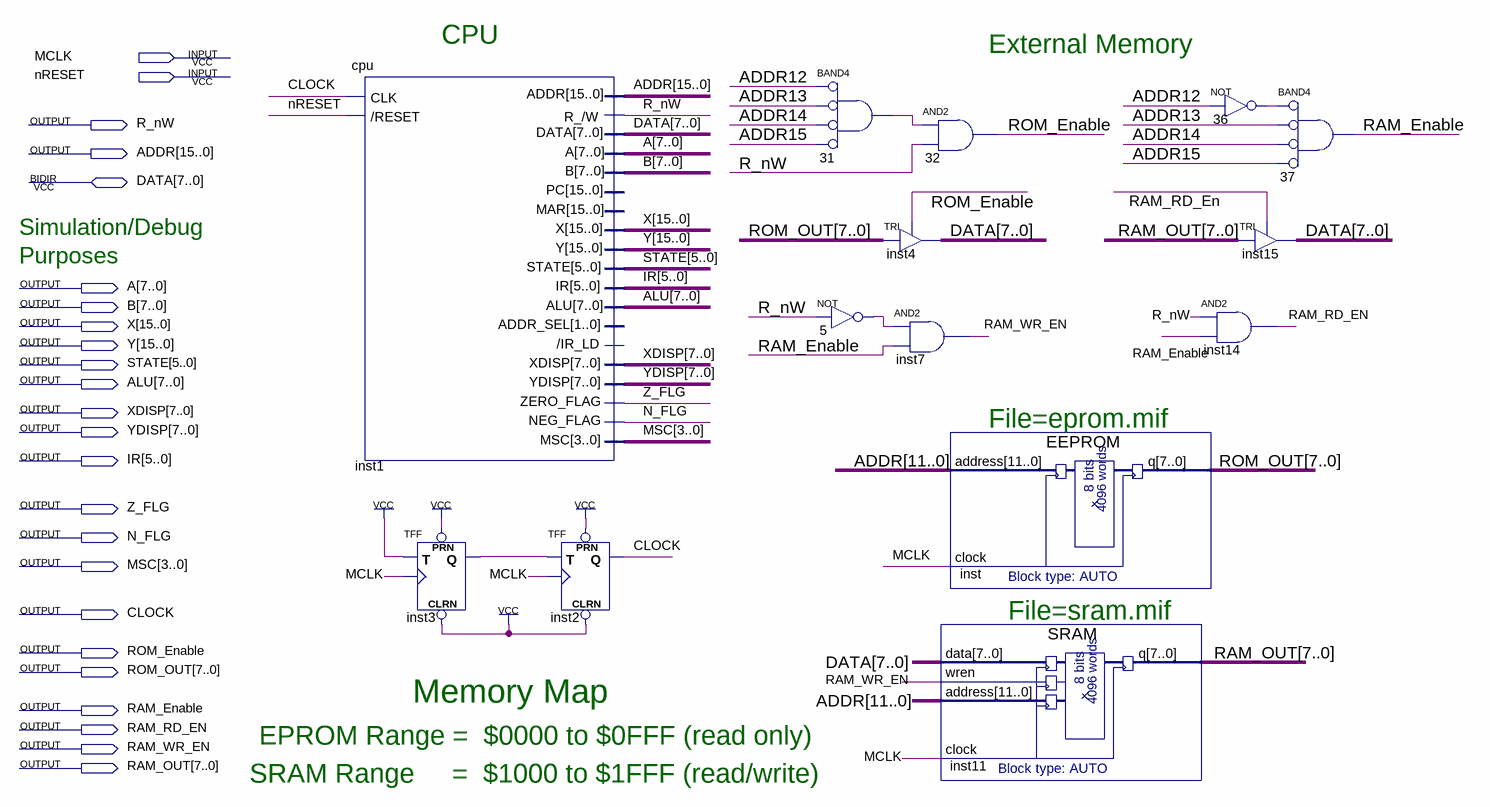
[diagram p0: schematic sheet]
// Quartus schematic computer.bdf as structural Verilog: 14 symbols, 24 pins
module computer (
  input  MCLK,
  input  nRESET,
  inout  [7:0] DATA,
  output R_nW,
  output [15:0] ADDR,
  output [7:0] A,
  output [7:0] B,
  output [15:0] X,
  output [15:0] Y,
  output [5:0] STATE,
  output [7:0] ALU,
  output [7:0] XDISP,
  output [7:0] YDISP,
  output [5:0] IR,
  output Z_FLG,
  output N_FLG,
  output [3:0] MSC,
  output CLOCK,
  output ROM_Enable,
  output [7:0] ROM_OUT,
  output RAM_Enable,
  output RAM_RD_EN,
  output RAM_WR_EN,
  output [7:0] RAM_OUT
);

  wire inst3_q, n5_out, n31_out, n36_out;

  cpu inst1 (
    .CLK(CLOCK), .\/RESET (nRESET), .ADDR(ADDR), .\R_/W (R_nW), .A(A), .B(B), .X(X), .Y(Y), .STATE(STATE),
    .IR(IR), .ALU(ALU), .XDISP(XDISP), .YDISP(YDISP), .ZERO_FLAG(Z_FLG), .NEG_FLAG(N_FLG), .MSC(MSC),
    .DATA(DATA));  // open: PC, MAR, ADDR_SEL, /IR_LD
  TFF inst3 (.PRN(1'b1), .CLRN(1'b1), .T(1'b1), .CLK(MCLK), .Q(inst3_q));
  TFF inst2 (.PRN(1'b1), .CLRN(1'b1), .T(inst3_q), .CLK(MCLK), .Q(CLOCK));
  and u_31 (n31_out, ~ADDR[12], ~ADDR[13], ~ADDR[14], ~ADDR[15]);  // BAND4
  not u_5 (n5_out, R_nW);
  and u_32 (ROM_Enable, n31_out, R_nW);
  TRI inst4[7:0] (.IN(ROM_OUT), .OE(ROM_Enable), .OUT(DATA));
  and inst7 (RAM_WR_EN, n5_out, RAM_Enable);
  SRAM inst11 (.data(DATA), .wren(RAM_WR_EN), .address(ADDR[11:0]), .clock(MCLK), .q(RAM_OUT));
  EEPROM inst (.address(ADDR[11:0]), .clock(MCLK), .q(ROM_OUT));
  not u_36 (n36_out, ADDR[12]);
  TRI inst15[7:0] (.IN(RAM_OUT), .OE(RAM_RD_EN), .OUT(DATA));
  and inst14 (RAM_RD_EN, R_nW, RAM_Enable);
  and u_37 (RAM_Enable, ~n36_out, ~ADDR[13], ~ADDR[14], ~ADDR[15]);  // BAND4

  // Notes on the sheet:
  //   CPU
  //   External Memory
  //   Simulation/Debug 
  //   Purposes
  //   File=eprom.mif
  //   File=sram.mif
  //   Memory Map
  //   EPROM Range =  $0000 to $0FFF (read only)
  //   SRAM Range     =  $1000 to $1FFF (read/write)
endmodule
